# Altium schematic sheet VIDEO_OUT_AD725.SchDoc: Composite Video Encoder
size A4; SheetNumber: 3; SheetTotal: 12
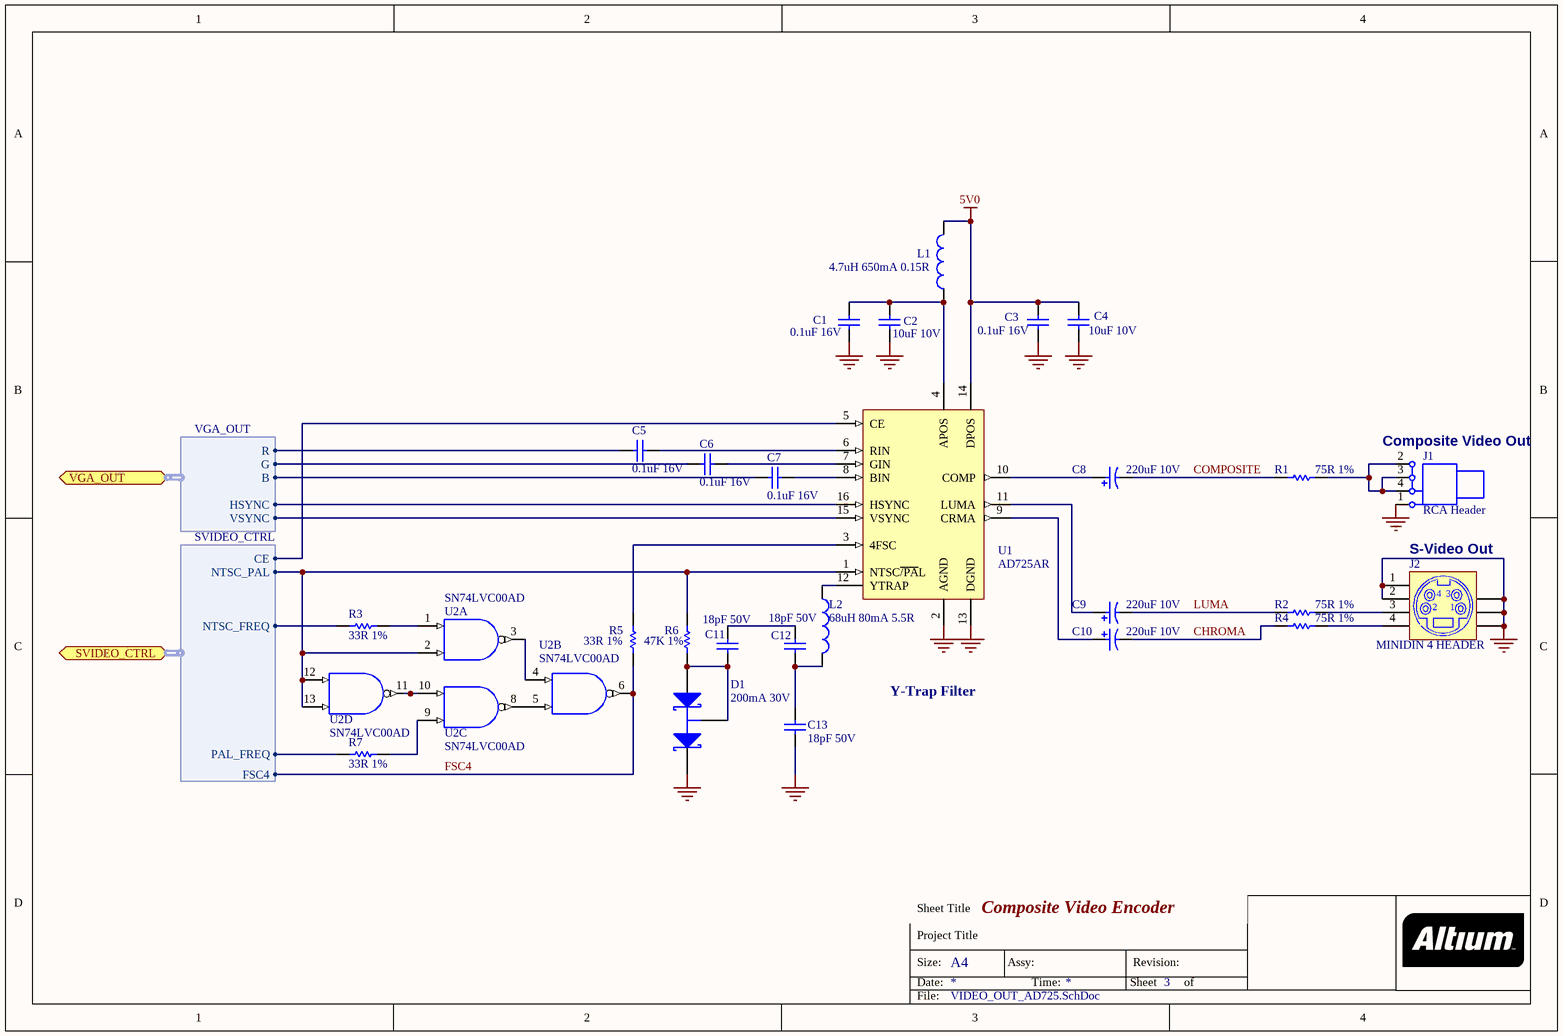
[diagram p0: VIDEO_OUT_AD725.SchDoc]

## Parts
C1  0.1uF 16V  [CAPC1005-STAR]
C2  10uF 10V  [CAPC2012-STAR]
C3  0.1uF 16V  [CAPC1005-STAR]
C4  10uF 10V  [CAPC2012-STAR]
C5  0.1uF 16V  [CAPC1005-STAR]
C6  0.1uF 16V  [CAPC1005-STAR]
C7  0.1uF 16V  [CAPC1005-STAR]
C8  220uF 10V  [CAPC7343-STAR]
C9  220uF 10V  [CAPC7343-STAR]
C10  220uF 10V  [CAPC7343-STAR]
C11  18pF 50V  [CAPC1005-STAR]
C12  18pF 50V  [CAPC1005-STAR]
C13  18pF 50V  [CAPC1005-STAR]
D1  200mA 30V  [SOT95P230-3C]
J1  RCA Header  [TRC-005]
J2  MINIDIN 4 HEADER  [MDJ-F-04]
L1  4.7uH 650mA 0.15R  [INDC3225]
L2  68uH 80mA 5.5R  [INDC3225]
R1  75R 1%  [RESC1005-STAR]
R2  75R 1%  [RESC1005-STAR]
R3  33R 1%  [RESC1005-STAR]
R4  75R 1%  [RESC1005-STAR]
R5  33R 1%  [RESC1005-STAR]
R6  47K 1%  [RESC1005-STAR]
R7  33R 1%  [RESC1005-STAR]
U1  AD725AR  [SOP127P1033-16]
U2  SN74LVC00AD  [SOIC127P600-14]  (parts A,B,C,D of 4)

## Ports
SVIDEO_CTRL (harness SVIDEO_CTRL), VGA_OUT (harness VGA_OUT)

## Harnesses
VGA_OUT: R, G, B, VSYNC, HSYNC
SVIDEO_CTRL: NTSC_PAL, FSC4, NTSC_FREQ, PAL_FREQ, CE

## Nets
3V3: U2.14(VDD)
5V0: C3.1 C4.1 L1.2 U1.14(DPOS)
GND: C1.2 C2.2 C3.2 C4.2 C13.2 D1.2(K) J1.1(Black) J2.1(D) J2.2(A) J2.MH1 J2.MH2 J2.MH3 U1.2(AGND) U1.13(DGND) U2.7(GND)
CHROMA: C10.2 R4.2
COMPOSITE: C8.2 R1.1
FSC4: R5.2 U2.6(Y) ; port SVIDEO_CTRL.FSC4
LUMA: C9.2 R2.2
NetC1_1: C1.1 C2.1 L1.1 U1.4(APOS)
NetC5_1: C5.1 ; port VGA_OUT.R
NetC5_2: C5.2 U1.6(RIN)
NetC6_1: C6.1 ; port VGA_OUT.G
NetC6_2: C6.2 U1.7(GIN)
NetC7_1: C7.1 ; port VGA_OUT.B
NetC7_2: C7.2 U1.8(BIN)
NetC8_1: C8.1 U1.10(COMP)
NetC9_1: C9.1 U1.11(LUMA)
NetC10_1: C10.1 U1.9(CRMA)
NetC11_1: C11.1 D1.1(A) D1.3(C) R6.2
NetC11_2: C11.2 C12.2
NetC12_1: C12.1 C13.1 L2.1
NetJ1_2: J1.2(Yellow) J1.3(White) J1.4(Red) R1.2
NetJ2_3: J2.3(H) R2.1
NetJ2_4: J2.4(E) R4.1
NetL2_2: L2.2 U1.12(YTRAP)
NetR3_1: R3.1 U2.1(A)
NetR3_2: R3.2 ; port SVIDEO_CTRL.NTSC_FREQ
NetR5_1: R5.1 U1.3(4FSC)
NetR6_1: R6.1 U1.1(NTSC~{/PA}L) U2.2(B) U2.12(A) U2.13(B) ; port SVIDEO_CTRL.NTSC_PAL
NetR7_1: R7.1 U2.9(A)
NetR7_2: R7.2 ; port SVIDEO_CTRL.PAL_FREQ
NetU1_5: U1.5(CE) ; port SVIDEO_CTRL.CE
NetU1_15: U1.15(VSYNC) ; port VGA_OUT.VSYNC
NetU1_16: U1.16(HSYNC) ; port VGA_OUT.HSYNC
NetU2_3: U2.3(Y) U2.4(A)
NetU2_5: U2.5(B) U2.8(Y)
NetU2_10: U2.10(B) U2.11(Y)

## Notes on the sheet
- (near J1) Composite Video Out
- S-Video Out
- Y-Trap Filter
- Sheet Title
- Project Title
- Size:
- Date:
- A4
- Assy:
- Time:
- Sheet
- Revision:
- of
- File:

## Library data of the parts
C1 C3 C5-C7 = D-101-0080: Capacitor, Ceramic, 0.1uF 10% 16V 0402 (1005) X7R; Polarity: Non-Polarized; Capacitance: 0.1 uF; Category: Capacitor; Dielectric: X7R; Mounting Technology: Surface Mount; Rated Voltage: 16 V; Status: Production; Technology: Ceramic; Tolerance: 10 %
C2 C4 = D-101-0087: Capacitor, Ceramic, 10uF 10% 10V 0805 (2012) X5R; Polarity: Non-Polarized; Capacitance: 10 uF; Category: Capacitor; Dielectric: X5R; Mounting Technology: Surface Mount; Rated Voltage: 10 V; Status: Unreleased; Technology: None; Tolerance: 10 %
C8-C10 = D-101-0088: Capacitor, Tantalum, 220uF 10% 10V MCCT-D (7343-31); Polarity: Polarized; Capacitance: 220 uF; Category: Capacitor; Mounting Technology: Surface Mount; Rated Voltage: 10 V; Status: Unreleased; Technology: Tantalum; Tolerance: 10 %
C11-C13 = D-101-0089: Capacitor, Ceramic, 18pF 5% 50V 0402 (1005) COG; Polarity: Non-Polarized; Rated Voltage: 50 mV; Capacitance: 18 pF; Category: Capacitor; Dielectric: COG; Mounting Technology: Surface Mount; Status: Unreleased; Technology: Ceramic; Tolerance: 5 %
D1 = D-151-0001: Schottky Diode, Dual-Serial, BAT54S 30V 200mA; Category: Diode-Schottky; Max Forward Current: 200 mA; Mounting Technology: Surface Mount; Rated Voltage: 30 V; Status: Production
J1 = D-300-0051: Connector, TRC-005-4 , RCA Phono Jack, Right Angle, Thru-Hole, Snap-In; Max Current: mA; Category: Connector; Connector type: Header; Mounting Technology: Through-Hole; Status: Unreleased
J2 = D-300-0050: Connector, 4850.241, Mini-DIN 4-Way, S-Video/Yellow; Max Current: mA; Category: Connector; Connector type: Header; Mounting Technology: Through-Hole; Status: Unreleased
L1 = D-102-0005: Inductor, 4.7uH 650mA 0.15R 1210 (3225) LQH32CN4R7M11L; Category: Inductor; Status: Production
L2 = D-102-0003: Inductor, 68uH 80mA 5.5R 1210 (3225) ELJFA680JF; Category: Inductor; Status: Production
R1 R2 R4 = D-100-0001: Resistor, 75R 1% 0402; Power Rating: mW; Resistance: mR; Category: Resistor; Mounting Technology: Surface Mount; Status: Production; Tolerance: 1 %
R3 R5 R7 = D-100-0102: Resistor, 33R 1% 0402 (1005); Power Rating: 63 mW; Category: Resistor; Mounting Technology: Surface Mount; Resistance: 33 R; Status: Production; Tolerance: 1 %
R6 = D-100-0092: Resistor, 47K 1% 0402 (1005); Power Rating: 63 mW; Category: Resistor; Mounting Technology: Surface Mount; Resistance: 47 K; Status: Production; Tolerance: 1 %
U1 = D-202-0002: AD725AR, Low Cost RGB to NTSC/PAL Encoder with Luma Trap Port; Category: IC-Video; Status: Production
U2 = D-205-0002: SN74LVC00AD, Quad 2-Input Positive-Nand Gates, 1.65-3.6V, 5V Tolerant Inputs; Category: IC-Logic; Status: Production